# EAGLE design circuit (EAGLE 6.6.0)
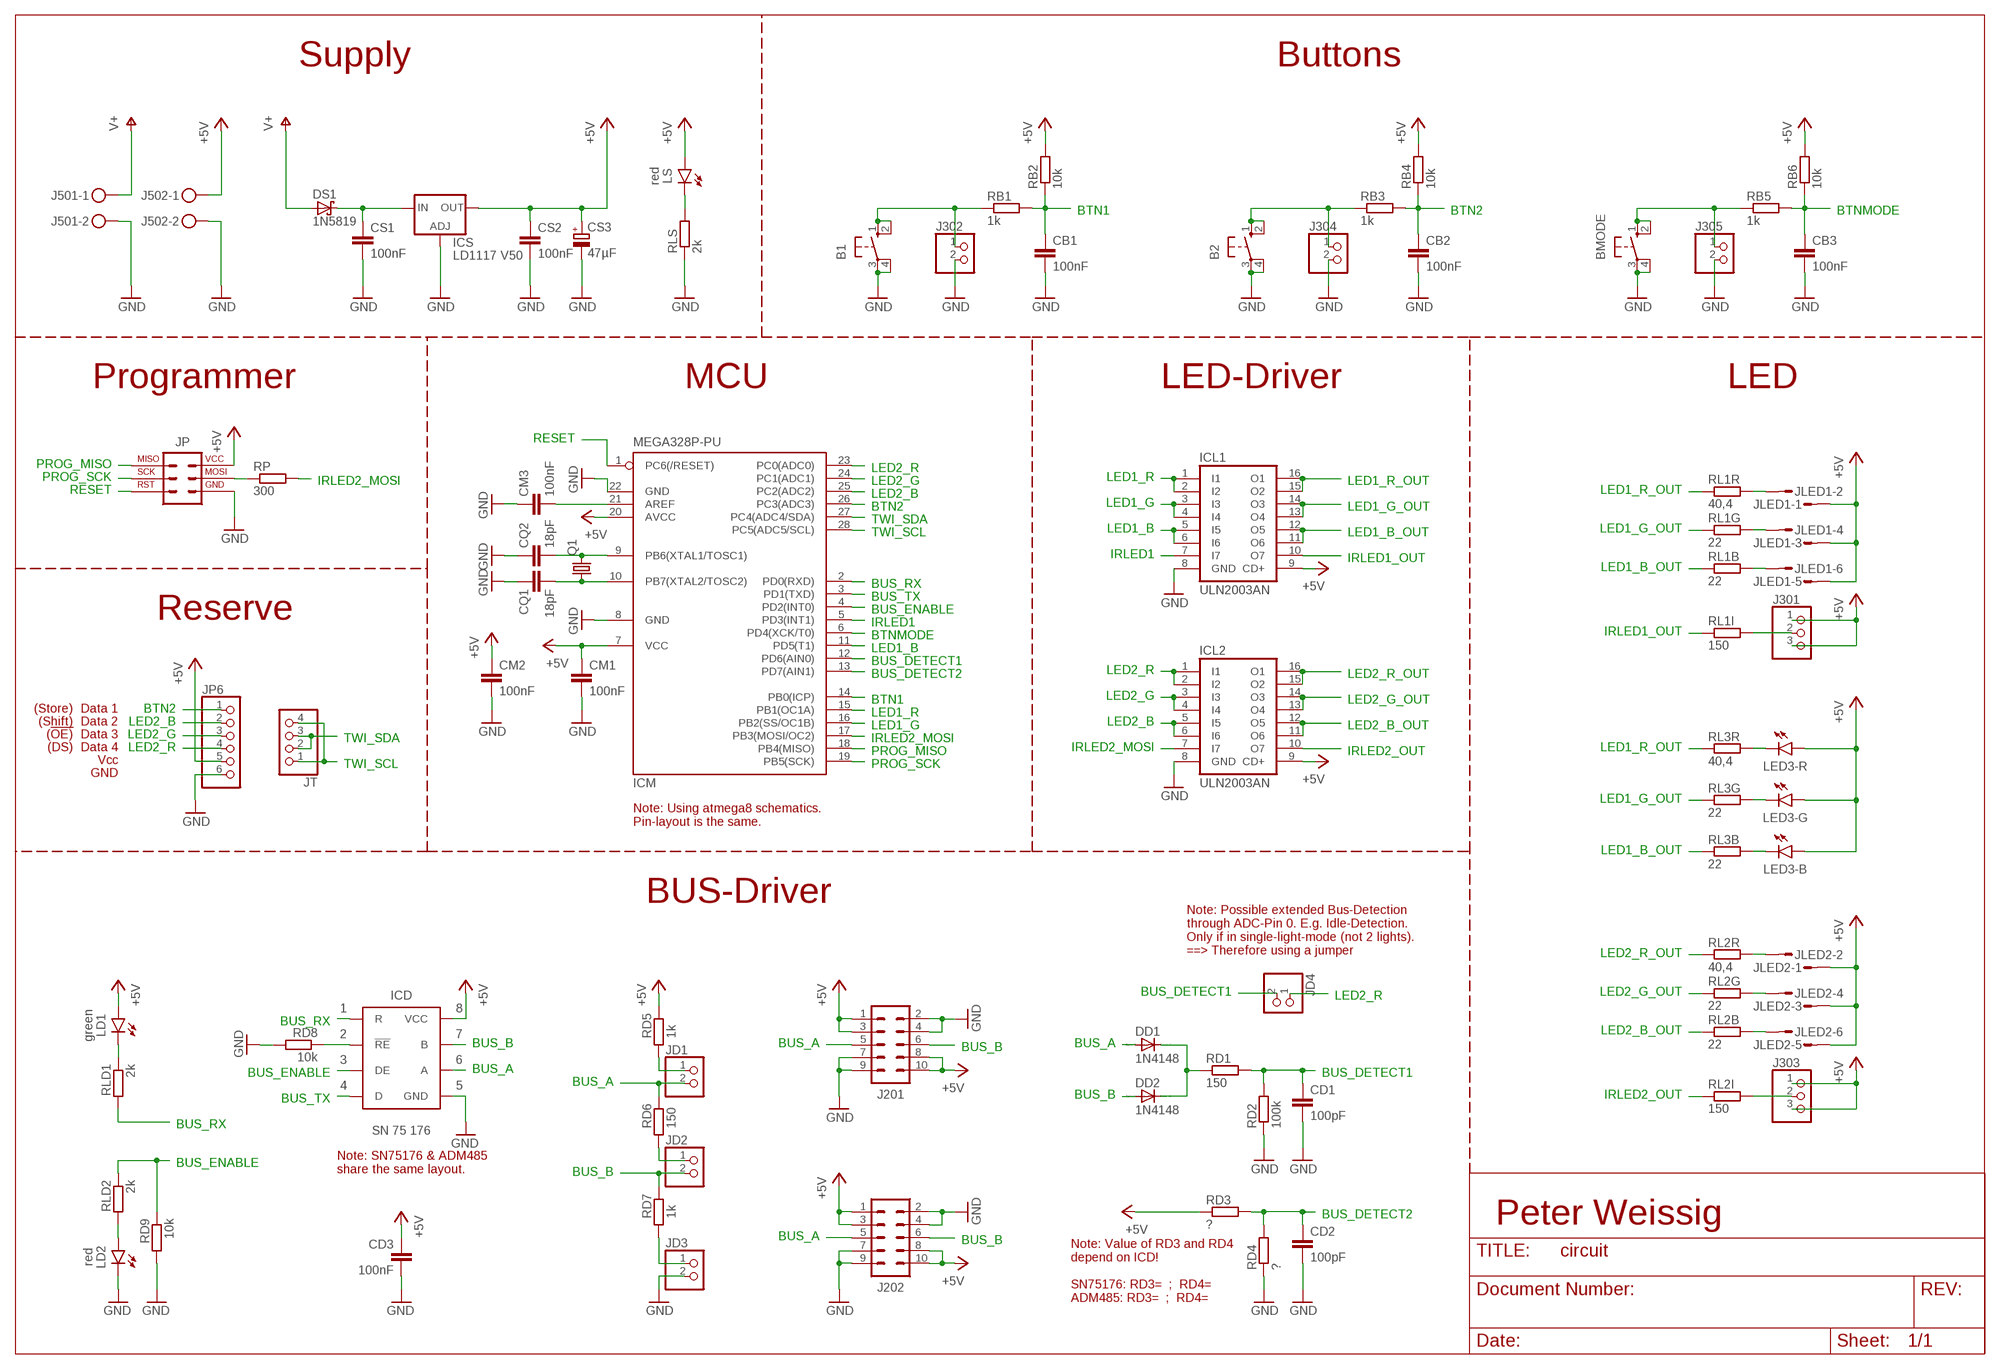
[diagram p0: schematic, sheet 1]

## Parts
B1  10-XX  [B3F-10XX]
B2  10-XX  [B3F-10XX]
BMODE  10-XX  [B3F-10XX]
CB1  100nF  C-EU025-025X050  [C025-025X050]
CB2  100nF  C-EU025-025X050  [C025-025X050]
CB3  100nF  C-EU025-025X050  [C025-025X050]
CD1  100pF  C-EU025-025X050  [C025-025X050]
CD2  100pF  C-EU025-025X050  [C025-025X050]
CD3  100nF  C-EU025-025X050  [C025-025X050]
CM1  100nF  C-EU025-025X050  [C025-025X050]
CM2  100nF  C-EU025-025X050  [C025-025X050]
CM3  100nF  C-EU025-025X050  [C025-025X050]
CQ1  18pF  C-EU025-025X050  [C025-025X050]
CQ2  18pF  C-EU025-025X050  [C025-025X050]
CS1  100nF  C-EU025-025X050  [C025-025X050]
CS2  100nF  C-EU025-025X050  [C025-025X050]
CS3  47µF  CPOL-EUE2-5  [E2-5]
DD1  1N4148  1N4148DO35-7  [DO35-7]
DD2  1N4148  1N4148DO35-7  [DO35-7]
DS1  1N5819  1N5819-B  [DO41-7.6]
ICD  DRIVER_RS485  [IC_DIL08]
ICL1  ULN2003AN  [DIL16]
ICL2  ULN2003AN  [DIL16]
ICM  MEGA328P-PU  MEGA8-P  [DIL28-3]
ICS  LD1117 V50  LD117AV50  [TO220L1]
J201  STECKER_WANNE_10  [STECKER_WANNE_10]
J202  STECKER_WANNE_10  [STECKER_WANNE_10]
J301  PINHD-1X3  [1X03]
J302  PINHD-1X2  [1X02]
J303  PINHD-1X3  [1X03]
J304  PINHD-1X2  [1X02]
J305  PINHD-1X2  [1X02]
J501  STECKER_SPG_2  [STECKER_SPG_2]
J502  STECKER_SPG_2  [STECKER_SPG_2]
JD1  PINHD-1X2  [1X02]
JD2  PINHD-1X2  [1X02]
JD3  PINHD-1X2  [1X02]
JD4  PINHD-1X2  [1X02]
JLED1  MICROMATCH-6  [MICROMATCH-6]
JLED2  MICROMATCH-6  [MICROMATCH-6]
JP  STECKER_ISP_6  [STECKER_WANNE_6]
JP6  PINHD-1X6/90  [1X06/90]
JT  PINHD-1X4  [1X04]
LD1  green  LED-3MM  [LED_3MM]
LD2  red  LED-3MM  [LED_3MM]
LED3  LED_3X  [LED_TOP_PLCC6]
LS  red  LED-3MM  [LED_3MM]
Q1  CRYSTALHC49U70  [HC49U70]
RB1  1k  R-EU_0207/10  [0207/10]
RB2  10k  R-EU_0207/10  [0207/10]
RB3  1k  R-EU_0207/10  [0207/10]
RB4  10k  R-EU_0207/10  [0207/10]
RB5  1k  R-EU_0207/10  [0207/10]
RB6  10k  R-EU_0207/10  [0207/10]
RD1  150  R-EU_0207/10  [0207/10]
RD2  100k  R-EU_0207/10  [0207/10]
RD3  ?  R-EU_0207/10  [0207/10]
RD4  ?  R-EU_0207/10  [0207/10]
RD5  1k  R-EU_0207/10  [0207/10]
RD6  150  R-EU_0207/10  [0207/10]
RD7  1k  R-EU_0207/10  [0207/10]
RD8  10k  R-EU_0207/10  [0207/10]
RD9  10k  R-EU_0207/10  [0207/10]
RL1B  22  R-EU_0207/10  [0207/10]
RL1G  22  R-EU_0207/10  [0207/10]
RL1I  150  R-EU_0207/10  [0207/10]
RL1R  40,4  R-EU_0207/10  [0207/10]
RL2B  22  R-EU_0207/10  [0207/10]
RL2G  22  R-EU_0207/10  [0207/10]
RL2I  150  R-EU_0207/10  [0207/10]
RL2R  40,4  R-EU_0207/10  [0207/10]
RL3B  22  R-EU_0207/10  [0207/10]
RL3G  22  R-EU_0207/10  [0207/10]
RL3R  40,4  R-EU_0207/10  [0207/10]
RLD1  2k  R-EU_0207/10  [0207/10]
RLD2  2k  R-EU_0207/10  [0207/10]
RLS  2k  R-EU_0207/10  [0207/10]
RP  300  R-EU_0207/10  [0207/10]

## Nets
+5V: CD3.1 CM1.1 CM2.1 CS2.1 CS3.+ ICD.8(VCC) ICL1.9(CD+) ICL2.9(CD+) ICM.7(VCC) ICM.20(AVCC) ICS.2(OUT) J201.1 J201.3 J201.8 J201.10 J202.1 J202.3 J202.8 J202.10 J301.1 J301.3 J303.1 J303.3 J502.1 JLED1.1 JLED1.3 JLED1.5 JLED2.1 JLED2.3 JLED2.5 JP6.5 JP.2(2_VCC) LD1.A LED3.1(-R:A) LED3.3(-G:A) LED3.4(-B:A) LS.A RB2.2 RB4.2 RB6.2 RD3.1 RD5.2
BTN1: CB1.1 ICM.14(PB0(ICP)) RB1.2 RB2.1
BTN2: CB2.1 ICM.26(PC3(ADC3)) JP6.1 RB3.2 RB4.1
BTNMODE: CB3.1 ICM.6(PD4(XCK/T0)) RB5.2 RB6.1
BUS_A: DD1.A ICD.6(A) J201.5 J202.5 JD1.2 RD6.2
BUS_B: DD2.A ICD.7(B) J201.6 J202.6 JD2.2 RD7.2
BUS_DETECT1: CD1.1 ICM.12(PD6(AIN0)) JD4.2 RD1.2 RD2.2
BUS_DETECT2: CD2.1 ICM.13(PD7(AIN1)) RD3.2 RD4.2
BUS_ENABLE: ICD.3(DE) ICM.4(PD2(INT0)) RD9.1 RLD2.1
BUS_RX: ICD.1(R) ICM.2(PD0(RXD)) RLD1.2
BUS_TX: ICD.4(D) ICM.3(PD1(TXD))
GND: B1.3(P) B1.4(P1) B2.3(P) B2.4(P1) BMODE.3(P) BMODE.4(P1) CB1.2 CB2.2 CB3.2 CD1.2 CD2.2 CD3.2 CM1.2 CM2.2 CM3.1 CQ1.1 CQ2.1 CS1.2 CS2.2 CS3.- ICD.5(GND) ICL1.8(GND) ICL2.8(GND) ICM.8(GND) ICM.22(GND) ICS.1(ADJ) J201.2 J201.4 J201.7 J201.9 J202.2 J202.4 J202.7 J202.9 J302.2 J304.2 J305.2 J501.2 J502.2 JD3.2 JP6.6 JP.6(6_GND) LD2.K(C) RD2.1 RD4.1 RD8.2 RD9.2 RLS.1
IRLED1: ICL1.7(I7) ICM.5(PD3(INT1))
IRLED1_OUT: ICL1.10(O7) RL1I.1
IRLED2_MOSI: ICL2.7(I7) ICM.17(PB3(MOSI/OC2)) RP.2
IRLED2_OUT: ICL2.10(O7) RL2I.1
LED1_B: ICL1.5(I5) ICL1.6(I6) ICM.11(PD5(T1))
LED1_B_OUT: ICL1.11(O6) ICL1.12(O5) RL1B.1 RL3B.1
LED1_G: ICL1.3(I3) ICL1.4(I4) ICM.16(PB2(SS/OC1B))
LED1_G_OUT: ICL1.13(O4) ICL1.14(O3) RL1G.1 RL3G.1
LED1_R: ICL1.1(I1) ICL1.2(I2) ICM.15(PB1(OC1A))
LED1_R_OUT: ICL1.15(O2) ICL1.16(O1) RL1R.1 RL3R.1
LED2_B: ICL2.5(I5) ICL2.6(I6) ICM.25(PC2(ADC2)) JP6.2
LED2_B_OUT: ICL2.11(O6) ICL2.12(O5) RL2B.1
LED2_G: ICL2.3(I3) ICL2.4(I4) ICM.24(PC1(ADC1)) JP6.3
LED2_G_OUT: ICL2.13(O4) ICL2.14(O3) RL2G.1
LED2_R: ICL2.1(I1) ICL2.2(I2) ICM.23(PC0(ADC0)) JD4.1 JP6.4
LED2_R_OUT: ICL2.15(O2) ICL2.16(O1) RL2R.1
N$4: B1.1(S) B1.2(S1) J302.1 RB1.1
N$5: CS1.1 DS1.C ICS.3(IN)
N$6: B2.1(S) B2.2(S1) J304.1 RB3.1
N$10: BMODE.1(S) BMODE.2(S1) J305.1 RB5.1
N$12: CQ1.2 ICM.10(PB7(XTAL2/TOSC2)) Q1.1
N$13: CQ2.2 ICM.9(PB6(XTAL1/TOSC1)) Q1.2
N$14: LS.K(C) RLS.2
N$15: CM3.2 ICM.21(AREF)
N$16: JLED1.2 RL1R.2
N$17: JLED1.4 RL1G.2
N$18: JLED1.6 RL1B.2
N$19: JLED2.2 RL2R.2
N$20: JLED2.4 RL2G.2
N$21: JLED2.6 RL2B.2
N$22: J303.2 RL2I.2
N$23: J301.2 RL1I.2
N$24: LED3.6(-R:C) RL3R.2
N$25: LED3.2(-G:C) RL3G.2
N$26: LED3.5(-B:C) RL3B.2
N$31: JD1.1 RD5.1
N$32: ICD.2(!RE) RD8.1
N$33: JD2.1 RD6.1
N$34: LD1.K(C) RLD1.1
N$35: JD3.1 RD7.1
N$36: DD1.C DD2.C RD1.1
N$37: LD2.A RLD2.2
PROG_MISO: ICM.18(PB4(MISO)) JP.1(1_MISO)
PROG_MOSI_1: JP.4(4_MOSI) RP.1
PROG_SCK: ICM.19(PB5(SCK)) JP.3(3_SCK)
RESET: ICM.1(PC6(/RESET)) JP.5(5_RST)
TWI_SCL: ICM.28(PC5(ADC5/SCL)) JT.1 JT.4
TWI_SDA: ICM.27(PC4(ADC4/SDA)) JT.2 JT.3
V+: DS1.A J501.1

## Notes on the sheet
- Supply | Buttons
- Programmer | MCU | LED-Driver | LED
- Reserve
- (Store) | Data 1
- (Shift) | Data 2
- (!OE) | Data 3
- (DS) | Data 4
- Vcc
- GND
- Note: Using atmega8 schematics.
  Pin-layout is the same.
- BUS-Driver
- Note: Possible extended Bus-Detection
  through ADC-Pin 0. E.g. Idle-Detection.
  Only if in single-light-mode (not 2 lights).
  ==> Therefore using a jumper
- Note: SN75176 & ADM485
  share the same layout.
- Peter Weissig
- Note: Value of RD3 and RD4
  depend on ICD!
  
  SN75176: RD3=  ;  RD4=
  ADM485: RD3=  ;  RD4=

## Library data of the parts
B1 B2 BMODE = switch-omron:10-XX: OMRON SWITCH; MPN: B3F-1000; OC_FARNELL: 176432; OC_NEWARK: 36M3542
CB1-CB3 CD1-CD3 CM1-CM3 CQ1 CQ2 CS1 CS2 = rcl:C-EU: CAPACITOR, European symbol
CS3 = rcl:CPOL-EU: POLARIZED CAPACITOR, European symbol
DD1 DD2 = diode:1N4148: DIODE high speed (Philips)
DS1 = diode:1N581*: 1.0A SCHOTTKY BARRIER RECTIFIER Source: http://www.diodes.com/datasheets/ds23001.pdf
ICD = robo_ag:DRIVER_RS485: RS485-Treiber Reichelt: SN 75176BP 5V
ICL1 ICL2 = uln-udn:ULN2003A: DRIVER ARRAY
ICM = atmel:MEGA8-P: MICROCONTROLLER 8 Kbytes FLASH, 1 kbytes SRAM, 512 bytes EEPROM, USART, 4-channel 10 bit ADC, 2-channel 8 bit ADC Pin compatible with Atmega48, ATMega88, ATMega168 Source: avr.lbr; OC_FARNELL: unknown; OC_NEWARK: unknown
ICS = v-reg:LD117A?*: Low drop fixed and adjustable positive voltage regulators 1 A Source: http://www.st.com/stonline/products/literature/ds/7194/ld1117axx.pdf
J201 J202 = robo_ag:STECKER_WANNE_10: Wannenstecker Reichelt:WSL 10G 2x5 THT
J301 J303 = pinhead:PINHD-1X3: PIN HEADER
J302 J304 J305 JD1-JD4 = pinhead:PINHD-1X2: PIN HEADER
J501 J502 = robo_ag:STECKER_SPG_2: Anschlussklemme Reichelt:AKL 101-02 Nicht Anreihbar Reichelt:AKL 057-02 Anreihbar
JLED1 JLED2 = con-amp-micromatch:MICROMATCH-6: MicroMaTch 6 7-215464-6 / 0-215464-6 Drawing Number C-215464 DDEController.pdf; MPN: 7-215464-6; OC_FARNELL: 3784630; OC_NEWARK: 19R8125
JP = robo_ag:STECKER_ISP_6: Wannenstecker Reichelt:WSL 6G 2x3 THT
JP6 = pinhead:PINHD-1X6: PIN HEADER
JT = pinhead:PINHD-1X4: PIN HEADER
LD1 LD2 LS = robo_ag:LED: Led Reichelt: LA E67B Variante: PLCC4 560-1400mcd 2,2V; 50mA Gelb-Orange SMD Reichelt: LA E67F Variante: PLCC4_REV 560mcd 2,65V; 50mA Orange SMD
LED3 = robo_ag:LED_3X: Led Reichelt: LRTB G6TG 280/900/180 mcd 2,1/3,2/3,2 V 20mA RGB-Led SMD
Q1 = crystal:CRYSTAL: CRYSTAL; OC_FARNELL: unknown; OC_NEWARK: unknown
RB1-RB6 RD1-RD9 RL1B RL1G RL1I RL1R RL2B RL2G RL2I RL2R RL3B RL3G RL3R RLD1 RLD2 RLS RP = rcl:R-EU_: RESISTOR, European symbol

## Board
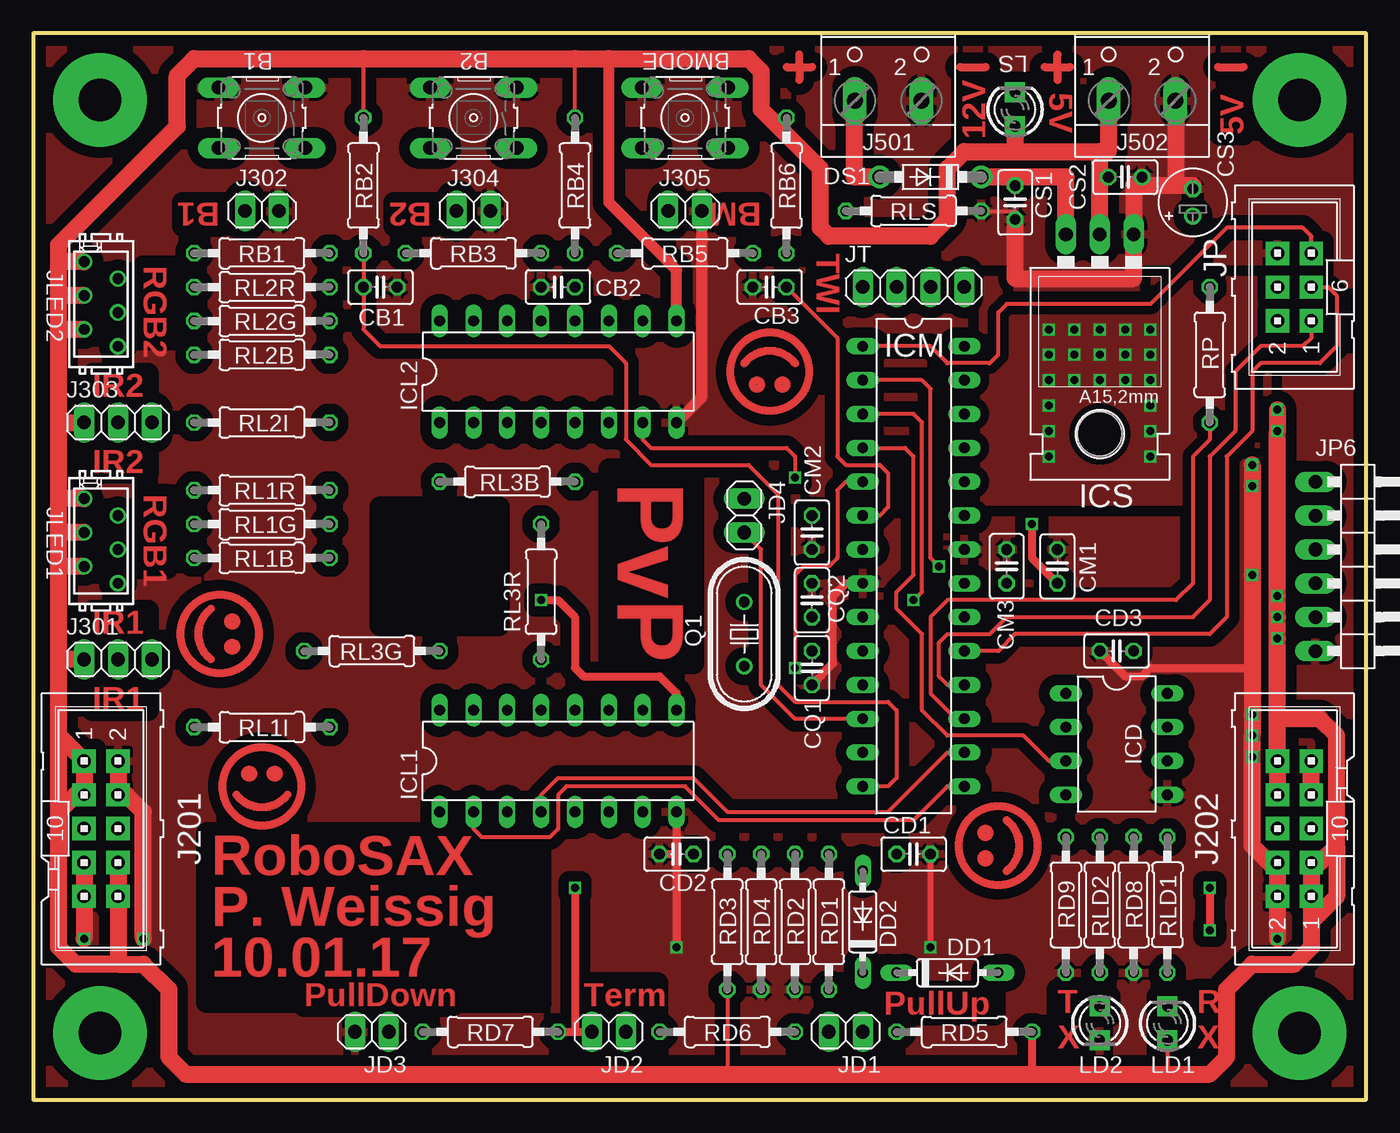
[diagram p1: board, top side]
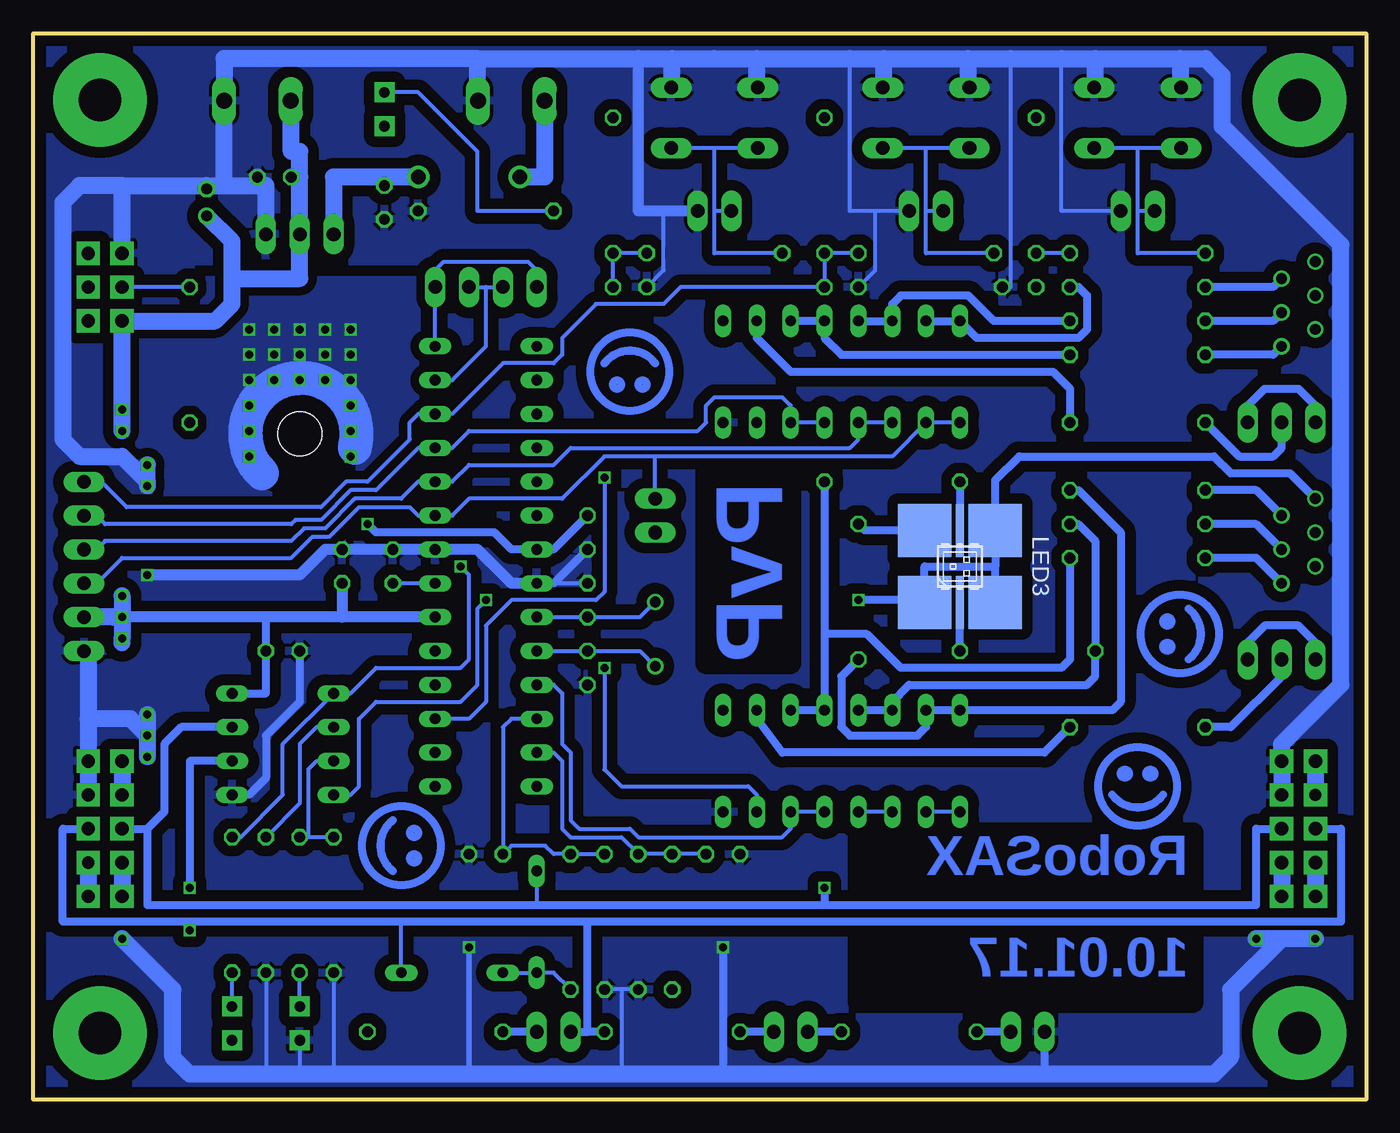
[diagram p2: board, bottom side, seen from below]

Size 100 x 80 mm. Coordinates in mm from the lower left corner, seen from the top.
Outline: 0,0 100,0 100,80 0,80 0,0
Copper layers (1*16): Top 0.035mm / dielectric 1.6mm / Bottom 0.035mm
Design rules "Elecrow_2-layer_PCB_eagle_rule": minimum track width 6mil, minimum drill 12mil, track to track 6mil, track to pad 6mil, pad to pad 6mil, via to via 8mil, smd to smd 0mil, copper to edge 20mil, drill to drill 10mil, minimum pad ring 6mil, minimum via ring 6mil, stop-mask expansion 0mil, vias tented up to drill 100mil, thermal gap 10mil
tRestrict: area 15.6,22 to 18.7,25; area 12.4,33.4 to 15.5,36.4; area 70.9,17.5 to 73.9,20.6; area 53.7,53.1 to 56.8,56.1; area 43.2,32.7 to 49.5,47.3; area 13,7.3 to 38.1,20; area 26,35.6 to 34.9,44.5
bRestrict: area 12.4,33.4 to 15.5,36.4; area 15.6,22 to 18.7,25; area 70.9,17.5 to 73.9,20.6; area 53.7,53.1 to 56.8,56.1; area 43.2,32.7 to 49.5,47.3; area 13,7.3 to 38.1,20

### Footprints (pad centres in the part's own frame; a part is rotated, then mirrored left to right if it is on the bottom)
B3F-10XX = drill 1.016 long: 1 -3.251,2.261; 2 3.251,2.261; 3 -3.251,-2.261; 4 3.251,-2.261
C025-025X050 = drill 0.813 octagon: 1 -1.27,0; 2 1.27,0
E2-5 = drill 0.813 pad 1.27: + -1.016,0 | drill 0.813 pad 1.27 octagon: - 1.016,0
DO35-7 = drill 0.813 long: A 3.81,0; C -3.81,0
DO41-7.6 = drill 1.1 pad 1.7: A 3.81,0; C -3.81,0
IC_DIL08 = drill 0.813 long: 1 -3.81,-3.81; 2 -1.27,-3.81; 3 1.27,-3.81; 4 3.81,-3.81; 5 3.81,3.81; 6 1.27,3.81; 7 -1.27,3.81; 8 -3.81,3.81
DIL16 = drill 0.813 long: 1 -8.89,-3.81; 2 -6.35,-3.81; 3 -3.81,-3.81; 4 -1.27,-3.81; 5 1.27,-3.81; 6 3.81,-3.81; 7 6.35,-3.81; 8 8.89,-3.81; 9 8.89,3.81; 10 6.35,3.81; 11 3.81,3.81; 12 1.27,3.81; 13 -1.27,3.81; 14 -3.81,3.81; 15 -6.35,3.81; 16 -8.89,3.81
DIL28-3 = drill 0.813 long: 1 -16.51,-3.81; 2 -13.97,-3.81; 3 -11.43,-3.81; 4 -8.89,-3.81; 5 -6.35,-3.81; 6 -3.81,-3.81; 7 -1.27,-3.81; 8 1.27,-3.81; 9 3.81,-3.81; 10 6.35,-3.81; 11 8.89,-3.81; 12 11.43,-3.81; 13 13.97,-3.81; 14 16.51,-3.81; 15 16.51,3.81; 16 13.97,3.81; 17 11.43,3.81; 18 8.89,3.81; 19 6.35,3.81; 20 3.81,3.81; 21 1.27,3.81; 22 -1.27,3.81; 23 -3.81,3.81; 24 -6.35,3.81; 25 -8.89,3.81; 26 -11.43,3.81; 27 -13.97,3.81; 28 -16.51,3.81
TO220L1 = drill 1.016 long: 1 -2.54,-3.81; 2 0,-3.81; 3 2.54,-3.81 | hole 3.302: 0,11.176
STECKER_WANNE_10 = drill 1 pad 1.75 square: 1 -5.08,-1.27; 2 -5.08,1.27; 4 -2.54,1.27; 5 0,-1.27; 6 0,1.27; 7 2.54,-1.27; 8 2.54,1.27; 9 5.08,-1.27; 10 5.08,1.27 | drill 0.914 pad 1.75 square: 3 -2.54,-1.27
1X03 = drill 1.016 long: 1 -2.54,0; 2 0,0; 3 2.54,0
1X02 = drill 1.016 long: 1 -1.27,0; 2 1.27,0
STECKER_SPG_2 = drill 1.194 long: 1 -2.5,-1.27; 2 2.5,-1.27
MICROMATCH-6 = drill 0.813: 1 3.175,1.27; 2 1.905,-1.27; 3 0.635,1.27; 4 -0.635,-1.27; 5 -1.905,1.27; 6 -3.175,-1.27
STECKER_WANNE_6 = drill 1 pad 1.75 square: 1 -2.54,-1.27; 2 -2.54,1.27; 3 0,-1.27; 4 0,1.27; 5 2.54,-1.27; 6 2.54,1.27
1X06/90 = drill 1.016 long: 1 -6.35,-3.81; 2 -3.81,-3.81; 3 -1.27,-3.81; 4 1.27,-3.81; 5 3.81,-3.81; 6 6.35,-3.81
1X04 = drill 1.016 long: 1 -3.81,0; 2 -1.27,0; 3 1.27,0; 4 3.81,0
LED_3MM = drill 0.8 pad 1.5 square: A -1.27,0; K 1.27,0
LED_TOP_PLCC6 = smd 4 x 4: 1 -2.65,-2.7; 3 2.65,-2.7; 4 2.65,2.7; 6 -2.65,2.7 | smd 0.6 x 4: 2 0,-2.7; 5 0,2.7
HC49U70 = drill 0.813: 1 -2.413,0; 2 2.413,0
0207/10 = drill 0.813 octagon: 1 -5.08,0; 2 5.08,0

### Placement (x,y rotation side)
B1  17.14,73.66 180 top
B2  33.02,73.66 180 top
BMODE  48.9,73.66 180 top
CB1  26.04,60.96 0 top
CB2  39.37,60.96 180 top
CB3  55.24,60.96 180 top
CD1  66.04,18.41 0 top
CD2  48.26,18.41 180 top
CD3  81.28,33.66 180 top
CM1  76.83,40.01 90 top
CM2  58.42,42.55 270 top
CM3  73.03,40.01 270 top
CQ1  58.42,32.38 90 top
CQ2  58.42,37.47 270 top
CS1  73.66,67.31 270 top
CS2  81.92,69.22 0 top
CS3  87,67.31 90 top
DD1  68.58,9.53 0 top
DD2  62.23,13.34 90 top
DS1  67.31,69.22 180 top
ICD  81.28,26.67 270 top
ICL1  39.37,25.4 0 top
ICL2  39.37,54.61 0 top
ICM  66.04,40.01 270 top
ICS  80.01,61.12 180 top
J201  5.08,20.32 270 top
J202  94.61,20.32 90 top
J301  6.35,33.02 0 top
J302  17.14,66.67 0 top
J303  6.35,50.8 0 top
J304  33.02,66.67 0 top
J305  48.9,66.67 0 top
J501  64.14,76.2 0 top
J502  83.19,76.2 0 top
JD1  60.96,5.08 180 top
JD2  43.18,5.08 180 top
JD3  25.4,5.08 180 top
JD4  53.34,43.81 270 top
JLED1  5.08,41.91 90 top
JLED2  5.08,59.69 90 top
JP  94.61,60.96 90 top
JP6  100,40 270 top
JT  66.04,60.96 0 top
LD1  85.09,5.71 90 top
LD2  80.01,5.71 270 top
LED3  30.48,40 0 bottom
LS  73.66,74.3 90 top
Q1  53.34,34.92 90 top
RB1  17.14,63.5 0 top
RB2  24.77,68.58 90 top
RB3  33.02,63.5 0 top
RB4  40.64,68.58 90 top
RB5  48.9,63.5 0 top
RB6  56.52,68.58 90 top
RD1  59.69,13.34 90 top
RD2  57.15,13.34 90 top
RD3  52.07,13.34 90 top
RD4  54.61,13.34 90 top
RD5  69.85,5.08 0 top
RD6  52.07,5.08 0 top
RD7  34.29,5.08 0 top
RD8  82.55,14.61 270 top
RD9  77.47,14.61 270 top
RL1B  17.14,40.64 180 top
RL1G  17.14,43.18 180 top
RL1I  17.14,27.94 180 top
RL1R  17.14,45.72 180 top
RL2B  17.14,55.88 180 top
RL2G  17.14,58.42 180 top
RL2I  17.14,50.8 180 top
RL2R  17.14,60.96 180 top
RL3B  35.56,46.35 180 top
RL3G  25.4,33.66 0 top
RL3R  38.1,38.1 90 top
RLD1  85.09,14.61 90 top
RLD2  80.01,14.61 270 top
RLS  66.04,66.67 180 top
RP  88.27,55.88 270 top

### Tracks (layer width: path | path; a pad name or v marks a point on that pad's centre or on a via)
+5V  (via drill 0.6)
  Top 0.305: RD3.1 52.07,1.91 | LD1.A 85.09,1.91 | RB2.2 24.77,78.11 | RB4.2 40.64,78.11 | RB6.2 55.88,73.03
  Top 0.61: RD5.2 74.93,1.91 | v74.93,43.18 74.93,40.64 CM1.1 | ICL1.9 48.26,30.48 46.99,31.75 41.27,31.75 40.64,32.38 40.64,36.2 39.37,37.47 v38.1,37.47
  Top 0.813: ICL2.9 48.26,62.23 43.18,67.31 43.18,78.11
  Top 1.27: J201.8 J201.10 6.35,10.16 | 80.64,74.93 80.64,71.12 80.01,71.12 | 73.66,71.12 69.85,71.12 68.58,69.85 68.58,66.04 67.31,64.77 59.69,64.77 59.05,65.41 59.05,69.85 55.88,73.03 54.61,74.3 54.61,77.15 53.66,78.11 43.18,78.11 40.64,78.11 24.77,78.11 12.06,78.11 10.79,76.83 10.79,73.03 1.91,64.14 1.91,62.87 | 73.66,71.12 80.01,71.12 | LS.A 73.66,71.12 | 6.35,10.16 3.17,10.16 1.91,11.43 1.91,21.59 | 1.91,21.59 1.91,27.3 | 1.91,27.3 J201.1 J201.3 3.17,22.86 1.91,21.59 | 6.35,10.16 8.26,10.16 10.16,8.26 10.16,3.17 11.43,1.91 52.07,1.91 74.93,1.91 85.09,1.91 88.27,1.91 89.53,3.17 89.53,8.26 91.44,10.16 94.61,10.16 95.89,11.43 95.89,13.34 | J202.8 J202.10 93.34,28.57 | 95.89,13.34 J202.1 J202.3 96.52,17.78 97.79,19.05 | 97.79,19.05 97.79,27.3 96.52,28.57 93.34,28.57 | 97.79,19.05 97.79,15.24 95.89,13.34 | 93.34,28.57 v93.34,34.61 v93.34,36.2 v93.34,37.78 v93.34,50.16 v93.34,51.75 | 1.91,27.3 1.91,33.02 | 1.91,33.02 1.91,40.01 | 1.91,40.01 1.91,42.55 | 1.91,42.55 1.91,45.09 | 1.91,45.09 1.91,50.8 | 1.91,50.8 1.91,57.78 | 1.91,57.78 1.91,60.33 | 1.91,60.33 1.91,62.87 | J301.1 1.91,33.02 | JLED1.5 1.91,40.01 | JLED1.3 1.91,42.55 | JLED1.1 1.91,45.09 | JLED2.5 1.91,57.78 | JLED2.1 1.91,62.87 | JLED2.3 1.91,60.33 | 1.91,50.8 J303.1 | ICS.2 80.01,69.22 | 80.01,69.22 80.01,71.12 | CS2.1 80.01,69.22
  Bottom 0.305: 80.69,75.56 J502.1 | LED3.3 27.83,36.94
  Bottom 0.61: J303.3 8.89,52.07 7.62,53.34 5.08,53.34 3.81,52.07 J303.1 | CM2.1 60.96,41.27 ICM.7 64.14,41.27 65.41,42.55 74.3,42.55 v74.93,43.18 | J301.1 3.81,34.29 5.08,35.56 7.62,35.56 8.89,34.29 J301.3 | ICD.8 82.55,30.48 CD3.1 82.55,36.2 | JLED1.1 5.71,46.99 10.16,46.99 11.43,48.26 26.04,48.26 27.83,46.47 LED3.4 27.83,40.01 27.94,40.01 | 27.94,40.01 33.13,40.01 LED3.1 33.13,37.47 v38.1,37.47 | LED3.3 27.83,39.9 27.94,40.01
  Bottom 0.813: ICM.20 76.83,36.2 | 76.83,36.2 82.55,36.2 93.98,36.2 | CM1.1 76.83,36.2
  Bottom 1.27: J201.8 J201.10 | J201.1 J201.3 | J202.3 J202.1 | J202.10 J202.8 | J502.1 80.64,74.93 80.64,71.12 80.01,71.12 80.01,69.22 | 85.09,61.59 80.01,61.59 ICS.2 80.01,69.22 | 85.09,61.59 85.09,59.69 86.36,58.42 JP.2 v93.34,51.75 v93.34,50.16 | 85.09,61.59 85.09,64.39 CS3.+ | v93.34,36.2 93.98,36.2 JP6.5 | v93.34,37.78 v93.34,34.61 93.34,34.29 | CS2.1 80.01,69.22
BTN1
  Top 0.305: RB2.1 CB1.1 24.77,57.78 26.04,56.52 43.18,56.52 44.45,55.24 44.45,49.53 46.35,47.62 53.66,47.62 55.88,45.4 55.88,31.11 57.15,29.84 64.14,29.84 64.77,29.21 64.77,24.13 64.14,23.5 ICM.14
  Bottom 0.305: RB1.2 RB2.1
BTN2
  Bottom 0.305: RB3.2 RB4.1 CB2.1 51.44,60.96 52.7,59.69 57.78,59.69 60.33,57.15 60.33,55.88 60.96,55.24 64.77,55.24 68.58,51.44 ICM.26 71.12,51.44 71.75,50.8 71.75,49.53 74.93,46.35 76.52,46.35 78.42,44.45 93.01,44.45 94.92,46.35 JP6.1
BTNMODE
  Top 0.305: CB3.1 60.33,57.15 60.33,48.26 60.96,47.62 63.5,47.62 64.14,46.99 64.14,44.45 63.5,43.81 ICM.6
  Bottom 0.305: RB5.2 RB6.1 CB3.1
BUS_A  (via drill 0.6)
  Top 0.61: v88.27,15.88 v88.27,12.7
  Bottom 0.305: DD1.A 72.39,13.34
  Bottom 0.61: J201.5 1.91,20.32 1.91,13.34 58.42,13.34 | 58.42,13.34 72.39,13.34 88.27,13.34 | 88.27,13.34 97.79,13.34 97.79,20.32 J202.5 | RD6.2 58.42,5.08 | JD1.2 58.42,5.08 | 58.42,5.08 58.42,13.34 | ICD.6 88.27,25.4 v88.27,15.88 | v88.27,12.7 88.27,13.34
BUS_B  (via drill 0.6)
  Top 0.61: v40.64,15.88 40.64,5.08 | 40.64,5.08 JD2.2 | RD7.2 40.64,5.08
  Bottom 0.305: DD2.A 62.23,14.61
  Bottom 0.61: J202.6 91.44,20.32 | 91.44,20.32 91.44,14.61 62.23,14.61 40.64,14.61 | 40.64,14.61 8.26,14.61 8.26,20.32 J201.6 | RD7.2 JD2.2 | v40.64,15.88 40.64,14.61 | ICD.7 88.9,27.94 90.17,26.67 90.17,21.59 91.44,20.32
BUS_DETECT1
  Top 0.305: ICM.12 57.15,28.57 54.61,31.11 54.61,41.27 JD4.2
  Bottom 0.305: RD2.2 RD1.2 60.96,18.41 61.59,19.05 64.14,19.05 CD1.1 64.77,27.94 64.14,28.57 ICM.12
BUS_DETECT2
  Bottom 0.305: CD2.1 RD3.2 RD4.2 55.88,19.68 59.69,19.68 60.33,20.32 60.33,25.4 60.96,26.04 ICM.13
BUS_ENABLE
  Top 0.305: ICD.3 76.2,25.4 74.3,27.3 68.58,27.3 66.67,29.21 66.67,34.92 64.77,36.83 64.77,38.1 66.04,39.37 66.04,48.26 65.41,48.9 ICM.4
  Bottom 0.305: ICD.3 78.74,25.4 79.38,24.77 79.38,19.68 | RD9.1 79.38,19.68 | 79.38,19.68 RLD2.1
BUS_RX  (via drill 0.6)
  Top 0.305: v67.94,40.01 67.31,40.64 67.31,53.34 66.67,53.98 ICM.2
  Bottom 0.305: v67.94,40.01 67.31,39.37 67.31,33.02 67.94,32.38 74.3,32.38 76.2,30.48 ICD.1 81.28,26.67 81.28,22.86 84.45,19.68 RLD1.2
BUS_TX  (via drill 0.6)
  Top 0.305: v66.04,37.47 66.67,38.1 66.67,50.8 66.04,51.44 ICM.3
  Bottom 0.305: ICD.4 76.2,22.86 75.56,23.5 75.56,28.57 74.3,29.84 67.94,29.84 66.67,31.11 66.67,36.83 v66.04,37.47
GND  (via drill 0.6)
  Top 0.305: RLS.1 73.66,66.67 CS1.2 | 92.08,17.78 92.39,18.1
  Top 0.406: CD1.2 v67.31,11.43
  Top 0.61: CD3.2 81.92,31.75 83.19,31.75 83.82,32.38 91.44,32.38 | ICL1.8 48.26,18.41 | 48.26,18.41 v48.26,11.43 | CD2.2 48.26,18.41 | CQ1.1 60.01,32.7 60.01,37.78 60.96,38.73 ICM.8
  Top 0.813: ICL2.8 50.16,52.7 J305.2
  Top 1.27: v3.81,12.06 J201.9 J201.7 | v8.26,12.06 8.26,21.59 6.99,22.86 J201.4 J201.2 | CS1.2 73.66,61.59 82.55,61.59 ICS.1 82.55,68.58 83.19,68.58 | 85.72,74.93 85.72,68.58 | 85.72,68.58 83.19,68.58 | 87,68.58 85.72,68.58 | J202.7 J202.9 | v93.34,12.06 J202.2 J202.4 92.71,17.78 92.39,18.1 91.44,19.05 v91.44,25.72 v91.44,27.3 v91.44,28.89 91.44,32.38 v91.44,39.37 v91.44,46.04 v91.44,47.62 | CS2.2 83.19,68.58
  Bottom 0.305: 49.53,78.11 48.9,78.11 | J302.2 22.86,66.67 22.86,78.11 | J304.2 36.83,66.67 | 36.83,66.67 38.73,66.67 38.73,78.11 | 55.88,8.26 RD2.1 | RD4.1 55.88,8.26 | 55.88,8.26 55.88,1.91 | CQ2.1 60.96,38.73 | CB3.2 52.7,62.23 52.7,66.67 | CB2.2 36.83,62.23 36.83,66.67 | LD2.K 80.01,1.91 | RD8.2 82.55,1.91 | RD9.2 77.47,1.91 | CB1.2 26.67,60.96 26.67,78.11
  Bottom 0.406: v67.31,11.43 67.31,1.91
  Bottom 0.61: JD3.2 24.13,1.91 | ICM.8 60.96,38.73 CM2.2 | CD3.2 80.01,29.84 82.55,27.3 82.55,24.13 83.82,22.86 ICD.5 | v48.26,11.43 48.26,1.91
  Bottom 0.813: J305.2 52.7,66.67 54.61,66.67 54.61,78.11 | v91.44,39.37 80.01,39.37 78.11,41.27 CM1.2 CM3.1 ICM.22 66.67,41.27 64.14,38.73 ICM.8
  Bottom 1.27: J201.7 J201.9 | J201.4 J201.2 6.35,26.67 1.91,31.11 1.91,64.14 10.79,73.03 10.79,76.83 12.06,78.11 13.97,78.11 | J202.4 J202.2 | J202.7 J202.9 95.89,28.57 | v3.81,12.06 6.35,12.06 | 6.35,12.06 v8.26,12.06 | J501.2 66.67,74.93 66.67,78.11 | 66.67,78.11 85.69,78.11 J502.2 | ICS.1 82.55,68.58 83.19,68.58 | 66.67,78.11 54.61,78.11 52.07,78.11 | 52.07,78.11 48.9,78.11 45.72,78.11 | 45.72,78.11 38.73,78.11 36.2,78.11 | 36.2,78.11 29.84,78.11 | 29.84,78.11 26.67,78.11 22.86,78.11 20.32,78.11 | 20.32,78.11 13.97,78.11 | B1.3 20.32,75.92 20.32,78.11 | B2.4 29.84,75.92 29.84,78.11 | B2.3 36.2,75.92 36.2,78.11 | BMODE.4 45.72,75.92 45.72,78.11 | BMODE.3 52.07,75.92 52.07,78.11 | 6.35,12.06 10.16,8.26 10.16,3.17 11.43,1.91 24.13,1.91 48.26,1.91 55.88,1.91 67.31,1.91 77.47,1.91 80.01,1.91 82.55,1.91 88.27,1.91 89.53,3.17 89.53,8.26 v93.34,12.06 | v91.44,27.3 92.71,28.57 95.89,28.57 | JP6.6 95.88,33.65 95.89,33.66 95.89,28.57 | JP.6 93.34,68.58 | 93.34,68.58 87,68.58 | 87,68.58 85.72,68.58 | 85.72,68.58 83.19,68.58 | 93.34,68.58 96.52,68.58 97.79,67.31 97.79,49.53 96.52,48.26 93.34,48.26 91.44,46.35 | CS3.- 87,68.58 | 85.72,74.93 85.72,68.58 | v91.44,27.3 v91.44,25.72 | v91.44,28.89 v91.44,27.3 | 91.44,46.35 v91.44,47.62 | 91.44,46.35 v91.44,46.04 | B1.4 13.89,78.03 13.97,78.11 | CS2.2 83.19,68.58
  pour Top (isolate 0.813, rank 2): 0,80.01 0,0 100.33,0 100.33,80.01
  pour Bottom (isolate 0.813, rank 2): 0,80.01 0,0 100.33,0 100.33,80.01
ICS_TAB  (via drill 0.6)
  Bottom 0.305: v76.2,48.26 75.88,48.26 75.88,48.9
  Bottom 2.54: 75.88,48.9 arc-240 82.87,46.99
  other vias: 76.2,55.88 76.2,57.78 78.11,57.78 80.01,57.78 78.11,55.88 76.2,53.98 78.11,53.98 80.01,55.88 81.92,57.78 81.92,55.88 81.92,53.98 83.82,57.78 83.82,55.88 83.82,53.98 76.2,52.07 83.82,52.07 76.2,50.16 80.01,53.98 83.82,50.16 83.82,48.26
  pour Bottom (isolate 0.635): 71.12,61.59 71.12,44.77 92.71,44.77 92.71,61.59
  pour Top (isolate 0.635): 71.12,61.59 71.12,44.77 92.71,44.77 92.71,61.59
IRLED1  (via drill 0.6)
  Top 0.305: ICM.5 60.96,46.35 60.33,45.72 60.33,40.64 59.69,40.01 57.78,40.01 57.15,39.37 v57.15,32.38
  Bottom 0.305: v57.15,32.38 57.15,24.77 55.88,23.5 46.35,23.5 45.72,22.86 ICL1.7
IRLED1_OUT
  Bottom 0.61: RL1I.1 24.13,26.04 43.81,26.04 45.72,28.57 ICL1.10
IRLED2_MOSI  (via drill 0.6)
  Top 0.305: RP.2 88.27,49.53 87,48.26 87,38.73 85.72,37.47 68.58,37.47 67.31,36.2 67.31,30.48 69.22,28.57 ICM.17 | ICL2.7 45.72,49.53 46.35,48.9 56.52,48.9 57.15,48.26 v57.15,46.67
  Bottom 0.305: ICM.17 67.31,28.57 66.04,29.84 66.04,35.56 64.14,37.47 57.78,37.47 57.15,38.1 v57.15,46.67
IRLED2_OUT
  Bottom 0.61: ICL2.10 45.72,57.15 43.18,54.61 23.5,54.61 22.23,53.34 RL2I.1
LED1_B
  Bottom 0.305: ICL1.5 ICL1.6 43.18,20.32 43.81,19.68 54.61,19.68 55.24,20.32 59.05,20.32 59.69,20.95 59.69,26.04 60.33,26.67 60.33,30.48 60.96,31.11 ICM.11
LED1_B_OUT
  Bottom 0.61: ICL1.11 ICL1.12 40.64,34.92 | RL3B.1 40.64,34.92 | RL1B.1 22.23,33.02 22.86,32.38 34.92,32.38 37.47,34.92 40.64,34.92
LED1_G
  Top 0.305: ICL1.4 38.1,22.86 39.37,24.13 49.53,24.13 52.07,21.59 64.14,21.59 68.58,26.04 ICM.16
  Bottom 0.305: ICL1.3 ICL1.4
LED1_G_OUT
  Bottom 0.305: RL1G.1 21.59,43.18
  Bottom 0.61: ICL1.13 ICL1.14 35.56,29.84 34.29,31.11 20.95,31.11 20.32,31.75 RL3G.1 20.32,41.91 21.59,43.18
LED1_R
  Top 0.305: ICM.15 68.58,23.5 66.04,20.95 51.44,20.95 48.9,23.5 40.01,23.5 39.37,22.86 39.37,20.32 38.73,19.68 33.66,19.68 33.02,20.32 ICL1.2
  Bottom 0.305: ICL1.1 ICL1.2
LED1_R_OUT
  Bottom 0.305: RL1R.1 21.59,45.72
  Bottom 0.61: 21.59,45.72 18.41,42.55 18.41,29.84 19.05,29.21 ICL1.16 ICL1.15 33.02,27.94 33.66,27.3 38.73,27.3 39.37,27.94 39.37,31.75 RL3R.1
LED2_B
  Bottom 0.305: JP6.2 95.25,43.81 94.61,43.18 80.64,43.18 80.33,43.5 78.42,43.5 76.2,45.72 74.3,45.72 71.12,48.9 ICM.25 68.58,48.9 67.31,50.16 50.16,50.16 49.53,50.8 49.53,52.07 48.9,52.7 43.81,52.7 43.18,52.07 ICL2.6 ICL2.5
LED2_B_OUT
  Bottom 0.61: ICL2.11 ICL2.12 40.64,57.15 39.37,55.88 RL2B.1
LED2_G
  Bottom 0.305: JP6.3 95.25,41.27 94.61,41.91 80.64,41.91 79.69,42.86 78.11,42.86 75.88,45.09 72.39,45.09 71.12,46.35 ICM.24 68.58,46.35 67.31,47.62 60.96,47.62 59.69,48.9 38.73,48.9 38.1,49.53 ICL2.4 ICL2.3
LED2_G_OUT
  Bottom 0.61: RL2G.1 27.94,58.42 29.84,60.33 34.92,60.33 35.56,59.69 ICL2.14 ICL2.13
LED2_R
  Bottom 0.305: JP6.4 95.25,38.73 93.34,40.64 80.64,40.64 79.06,42.23 77.79,42.23 75.56,44.45 71.75,44.45 71.12,43.81 ICM.23 68.58,43.81 67.31,45.09 60.33,45.09 57.15,48.26 53.34,48.26 | ICL2.1 ICL2.2 35.56,48.26 53.34,48.26 | JD4.1 53.34,48.26
LED2_R_OUT
  Bottom 0.61: RL2R.1 21.59,60.96 20.95,60.33 20.95,57.78 21.59,57.15 29.21,57.15 ICL2.16 ICL2.15
N$1
  Top 0.61: 19.05,22.86 arc-105 15.24,22.86
N$2
  Bottom 0.61: 19.05,22.86 arc-105 15.24,22.86
N$3
  Top 0.61: 13.34,33.02 arc-105 13.34,36.83
N$4
  Bottom 0.305: B1.2 17.14,71.4 | 17.14,71.4 B1.1 | J302.1 17.14,66.67 | 17.14,66.67 17.14,71.4 | RB1.1 17.14,63.5 17.14,66.67
N$5
  Top 1.27: ICS.3 77.47,69.22 73.66,69.22 | 73.66,69.22 DS1.C | CS1.1 73.66,69.22
  Bottom 1.27: DS1.C 73.66,69.22 | 73.66,69.22 77.47,69.22 ICS.3 | CS1.1 73.66,69.22
N$6
  Bottom 0.305: B2.2 33.02,71.4 | 33.02,71.4 B2.1 | J304.1 33.02,66.67 | 33.02,66.67 33.02,71.4 | RB3.1 33.02,63.5 33.02,66.67
N$10
  Bottom 0.305: BMODE.2 48.9,71.4 | 48.9,71.4 BMODE.1 | J305.1 48.9,66.67 | 48.9,66.67 48.9,71.4 | RB5.1 48.9,63.5 48.9,66.67
N$12
  Bottom 0.305: ICM.10 CQ1.2 54.48,33.66 Q1.1
N$13
  Bottom 0.305: ICM.9 CQ2.2 54.48,36.2 Q1.2
N$14
  Bottom 0.305: RLS.2 66.67,66.67 66.67,71.12 71.12,75.56 LS.K
N$15
  Bottom 0.305: ICM.21 CM3.2
N$16
  Bottom 0.61: JLED1.2 8.26,45.72 RL1R.2
N$17
  Bottom 0.61: JLED1.4 8.26,43.18 RL1G.2
N$18
  Bottom 0.61: JLED1.6 8.26,40.64 RL1B.2
N$19
  Bottom 0.61: JLED2.2 6.99,60.96 RL2R.2
N$20
  Bottom 0.61: JLED2.4 6.99,58.42 RL2G.2
N$21
  Bottom 0.61: JLED2.6 6.99,55.88 RL2B.2
N$22
  Bottom 0.61: RL2I.2 9.53,48.26 6.99,48.26 6.35,48.9 J303.2
N$23
  Bottom 0.61: J301.2 6.35,31.75 10.16,27.94 RL1I.2
N$24
  Bottom 0.61: LED3.6 37.62,42.7 RL3R.2
N$25
  Bottom 0.61: RL3G.2 LED3.2
N$26
  Bottom 0.61: RL3B.2 LED3.5
N$27  (via drill 3.2 pad 7)
  other vias: 5,5
N$28  (via drill 3.2 pad 7)
  other vias: 95,5
N$29  (via drill 3.2 pad 7)
  other vias: 95,75
N$30  (via drill 3.2 pad 7)
  other vias: 5,75
N$31
  Bottom 0.61: JD1.1 RD5.1
N$32
  Bottom 0.305: ICD.2 78.74,27.94 80.01,26.67 80.01,22.23 RD8.1
N$33
  Bottom 0.61: JD2.1 RD6.1
N$34
  Bottom 0.305: LD1.K RLD1.1
N$35
  Bottom 0.61: JD3.1 RD7.1
N$36
  Bottom 0.305: DD1.C DD2.C 60.96,9.53 RD1.1
N$37
  Bottom 0.305: LD2.A RLD2.2
N$38
  Bottom 0.61: 13.34,33.02 arc-105 13.34,36.83
N$39
  Top 0.61: 75.88,77.47 76.83,77.47 | 76.83,77.47 77.79,77.47 | 76.83,77.47 76.83,78.42 | 76.83,77.47 76.83,76.52
N$40
  Top 0.61: 73.03,20.95 arc-105 73.03,17.14
N$41
  Bottom 0.61: 73.03,20.95 arc-105 73.03,17.14
N$42
  Top 0.61: 53.34,55.24 arc-105 57.15,55.24
N$43
  Bottom 0.61: 53.34,55.24 arc-105 57.15,55.24
N$44
  Top 0.61: 88.9,77.47 90.81,77.47
N$45
  Top 0.61: 69.53,77.47 71.44,77.47
N$46
  Top 0.61: 56.52,77.47 57.47,77.47 | 57.47,77.47 58.42,77.47 | 57.47,77.47 57.47,76.52 | 57.47,77.47 57.47,78.42
PROG_MISO
  Top 0.305: JP.1 95.89,57.15 95.25,56.52 92.08,56.52 90.17,54.61 90.17,50.16 88.27,48.26 88.27,37.47 87,36.2 73.03,36.2 71.75,34.92 68.58,34.92 67.94,34.29 67.94,31.75 68.58,31.11 ICM.18
PROG_MOSI_1
  Bottom 0.305: RP.1 JP.4
PROG_SCK
  Top 0.305: JP.3 97.16,60.96 97.79,60.33 97.79,56.52 96.52,55.24 92.08,55.24 91.44,54.61 91.44,50.16 89.53,48.26 89.53,36.2 88.27,34.92 73.66,34.92 72.39,33.66 ICM.19
RESET
  Top 0.305: JP.5 95.89,64.77 95.25,65.41 89.53,65.41 83.82,59.69 73.03,59.69 72.39,59.05 72.39,55.88 71.75,55.24 68.58,55.24 67.31,56.52 ICM.1
TWI_SCL
  Bottom 0.305: ICM.28 JT.4 69.85,62.23 69.22,62.87 62.87,62.87 62.23,62.23 JT.1
TWI_SDA
  Bottom 0.305: ICM.27 68.58,53.98 66.04,56.52 66.04,60.96 | 66.04,60.96 JT.2 | JT.3 66.04,60.96
V+
  Top 1.27: DS1.A 61.59,69.22 61.59,74.93
  Bottom 1.27: J501.1 61.63,69.22 DS1.A
(copper drawn outside any net)
  shapes: Bottom circle x12, Top circle x12

### Text on the board
Top: 5V | 12V | 5V | B1 | B2 | BM | TWI | RGB2 | IR2 | IR2 | PvP | RGB1 | IR1 | IR1 | RoboSAX | P. Weissig | 10.01.17 | PullDown | Term | PullUp | T / X | R / X
Bottom: PvP | RoboSAX | 10.01.17